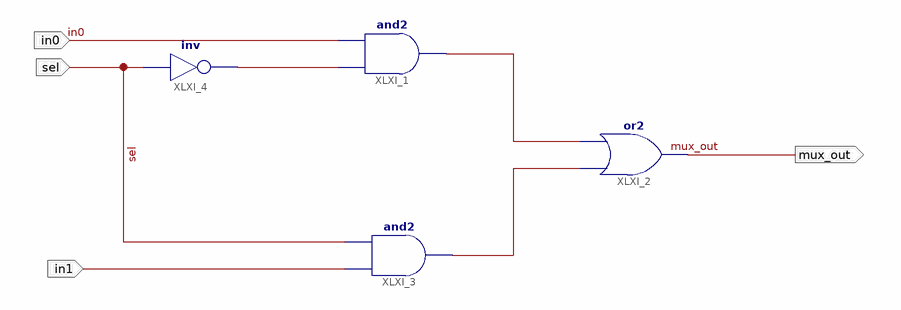
[diagram p0: schematic sheet 1]
// Xilinx ISE schematic mux.sch (spartan3e) as structural Verilog: 4 symbols, 4 ports
module mux (
  input  in0,
  input  sel,
  input  in1,
  output mux_out
);

  wire XLXN_2, XLXN_5, XLXN_6;

  and XLXI_1 (XLXN_5, XLXN_2, in0);
  or XLXI_2 (mux_out, XLXN_6, XLXN_5);
  and XLXI_3 (XLXN_6, in1, sel);
  not XLXI_4 (XLXN_2, sel);
endmodule
